# Altium project Rear.PrjPCB
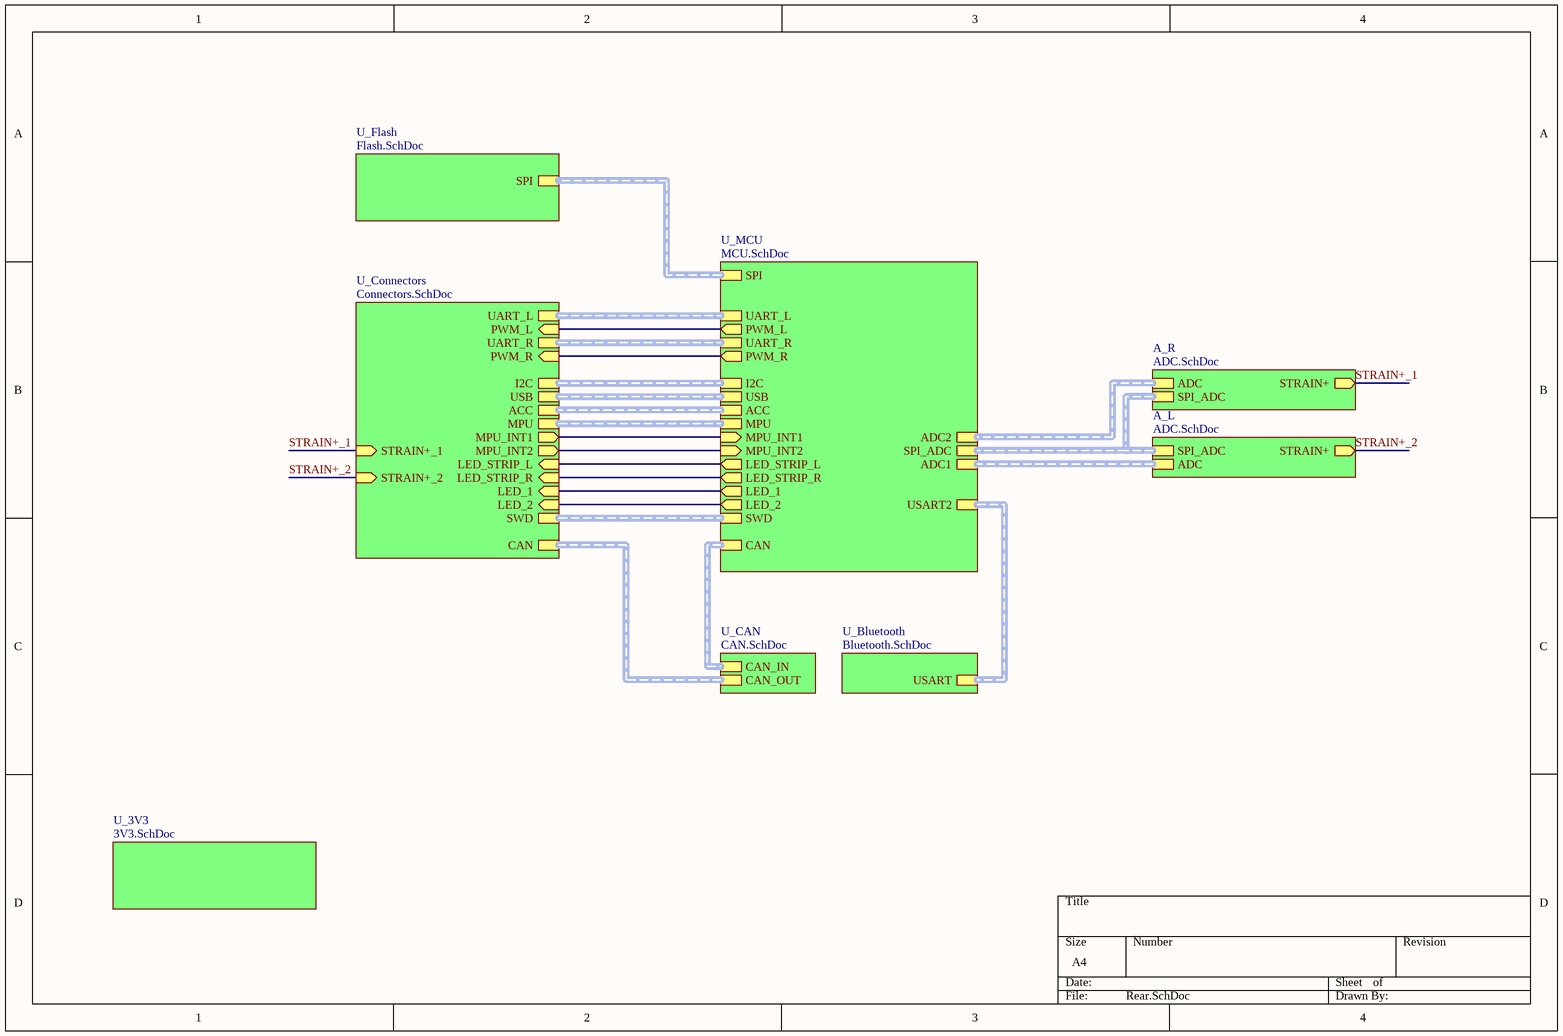
[diagram p0: Rear.SchDoc]
8 sheets, 135 parts. Net scope: hierarchical (ports join the sheet entries above them; power ports are global).
Board file: Rear.PcbDoc
Sheets:
  Rear.SchDoc
    U_MCU = MCU.SchDoc
    A_L = ADC.SchDoc
    A_R = ADC.SchDoc
    U_Connectors = Connectors.SchDoc
    U_CAN = CAN.SchDoc
    U_Bluetooth = Bluetooth.SchDoc
    U_3V3 = 3V3.SchDoc
    U_Flash = Flash.SchDoc

## Sheet Rear.SchDoc
size A4

### Sub-sheets
A_L = ADC.SchDoc: SPI_ADC (harness SPI_ADC), ADC (harness ADC), STRAIN+ (out)
A_R = ADC.SchDoc: SPI_ADC (harness SPI_ADC), ADC (harness ADC), STRAIN+ (out)
U_3V3 = 3V3.SchDoc: no entries
U_Bluetooth = Bluetooth.SchDoc: USART (harness UART)
U_CAN = CAN.SchDoc: CAN_IN (harness CAN Input), CAN_OUT (harness CAN Output)
U_Connectors = Connectors.SchDoc: USB (harness USB), ACC (harness Accessory Outputs), CAN (harness CAN Output), MPU (harness I2C), MPU_INT1 (out), MPU_INT2 (out), STRAIN+_1 (in), STRAIN+_2 (in), LED_STRIP_L (in), LED_STRIP_R (in), SWD (harness SWD), LED_1 (in), LED_2 (in), UART_L (harness UART), UART_R (harness UART), PWM_L (in), PWM_R (in), I2C (harness I2C)
U_Flash = Flash.SchDoc: SPI (harness SPI)
U_MCU = MCU.SchDoc: USB (harness USB), CAN (harness CAN Input), ACC (harness Accessory Outputs), I2C (harness I2C), SPI_ADC (harness SPI_ADC), USART2 (harness UART), ADC1 (harness ADC), ADC2 (harness ADC), MPU (harness I2C), MPU_INT1 (in), MPU_INT2 (in), SPI, LED_STRIP_L (out), LED_STRIP_R (out), SWD (harness SWD), LED_1 (out), LED_2 (out), UART_L (harness UART), UART_R (harness UART), PWM_L (out), PWM_R (out)

### Nets
STRAIN+_1: sheet A_R/STRAIN+, sheet U_Connectors/STRAIN+_1  [project net AINP]
STRAIN+_2: sheet A_L/STRAIN+, sheet U_Connectors/STRAIN+_2  [project net AINP]
NetJP1_3: sheet U_MCU/PWM_L, sheet U_Connectors/PWM_L
NetJP4_3: sheet U_MCU/PWM_R, sheet U_Connectors/PWM_R
NetJP8_2: sheet U_MCU/LED_STRIP_L, sheet U_Connectors/LED_STRIP_L
NetJP9_2: sheet U_MCU/LED_STRIP_R, sheet U_Connectors/LED_STRIP_R
NetJP10_1: sheet U_MCU/MPU_INT1, sheet U_Connectors/MPU_INT1
NetJP11_1: sheet U_MCU/MPU_INT2, sheet U_Connectors/MPU_INT2
NetJP16_2: sheet U_MCU/LED_1, sheet U_Connectors/LED_1
NetJP17_2: sheet U_MCU/LED_2, sheet U_Connectors/LED_2

### Buses and harness runs
harness sheet A_L/ADC = sheet U_MCU/ADC1
harness sheet A_L/SPI_ADC = sheet A_R/SPI_ADC = sheet U_MCU/SPI_ADC
harness sheet A_R/ADC = sheet U_MCU/ADC2
harness sheet U_Bluetooth/USART = sheet U_MCU/USART2
harness sheet U_CAN/CAN_IN = sheet U_MCU/CAN
harness sheet U_CAN/CAN_OUT = sheet U_Connectors/CAN
harness sheet U_Connectors/ACC = sheet U_MCU/ACC
harness sheet U_Connectors/I2C = sheet U_MCU/I2C
harness sheet U_Connectors/MPU = sheet U_MCU/MPU
harness sheet U_Connectors/SWD = sheet U_MCU/SWD
harness sheet U_Connectors/UART_L = sheet U_MCU/UART_L
harness sheet U_Connectors/UART_R = sheet U_MCU/UART_R
harness sheet U_Connectors/USB = sheet U_MCU/USB
harness sheet U_Flash/SPI = sheet U_MCU/SPI

## Sheet MCU.SchDoc
size A3; SheetNumber: 3
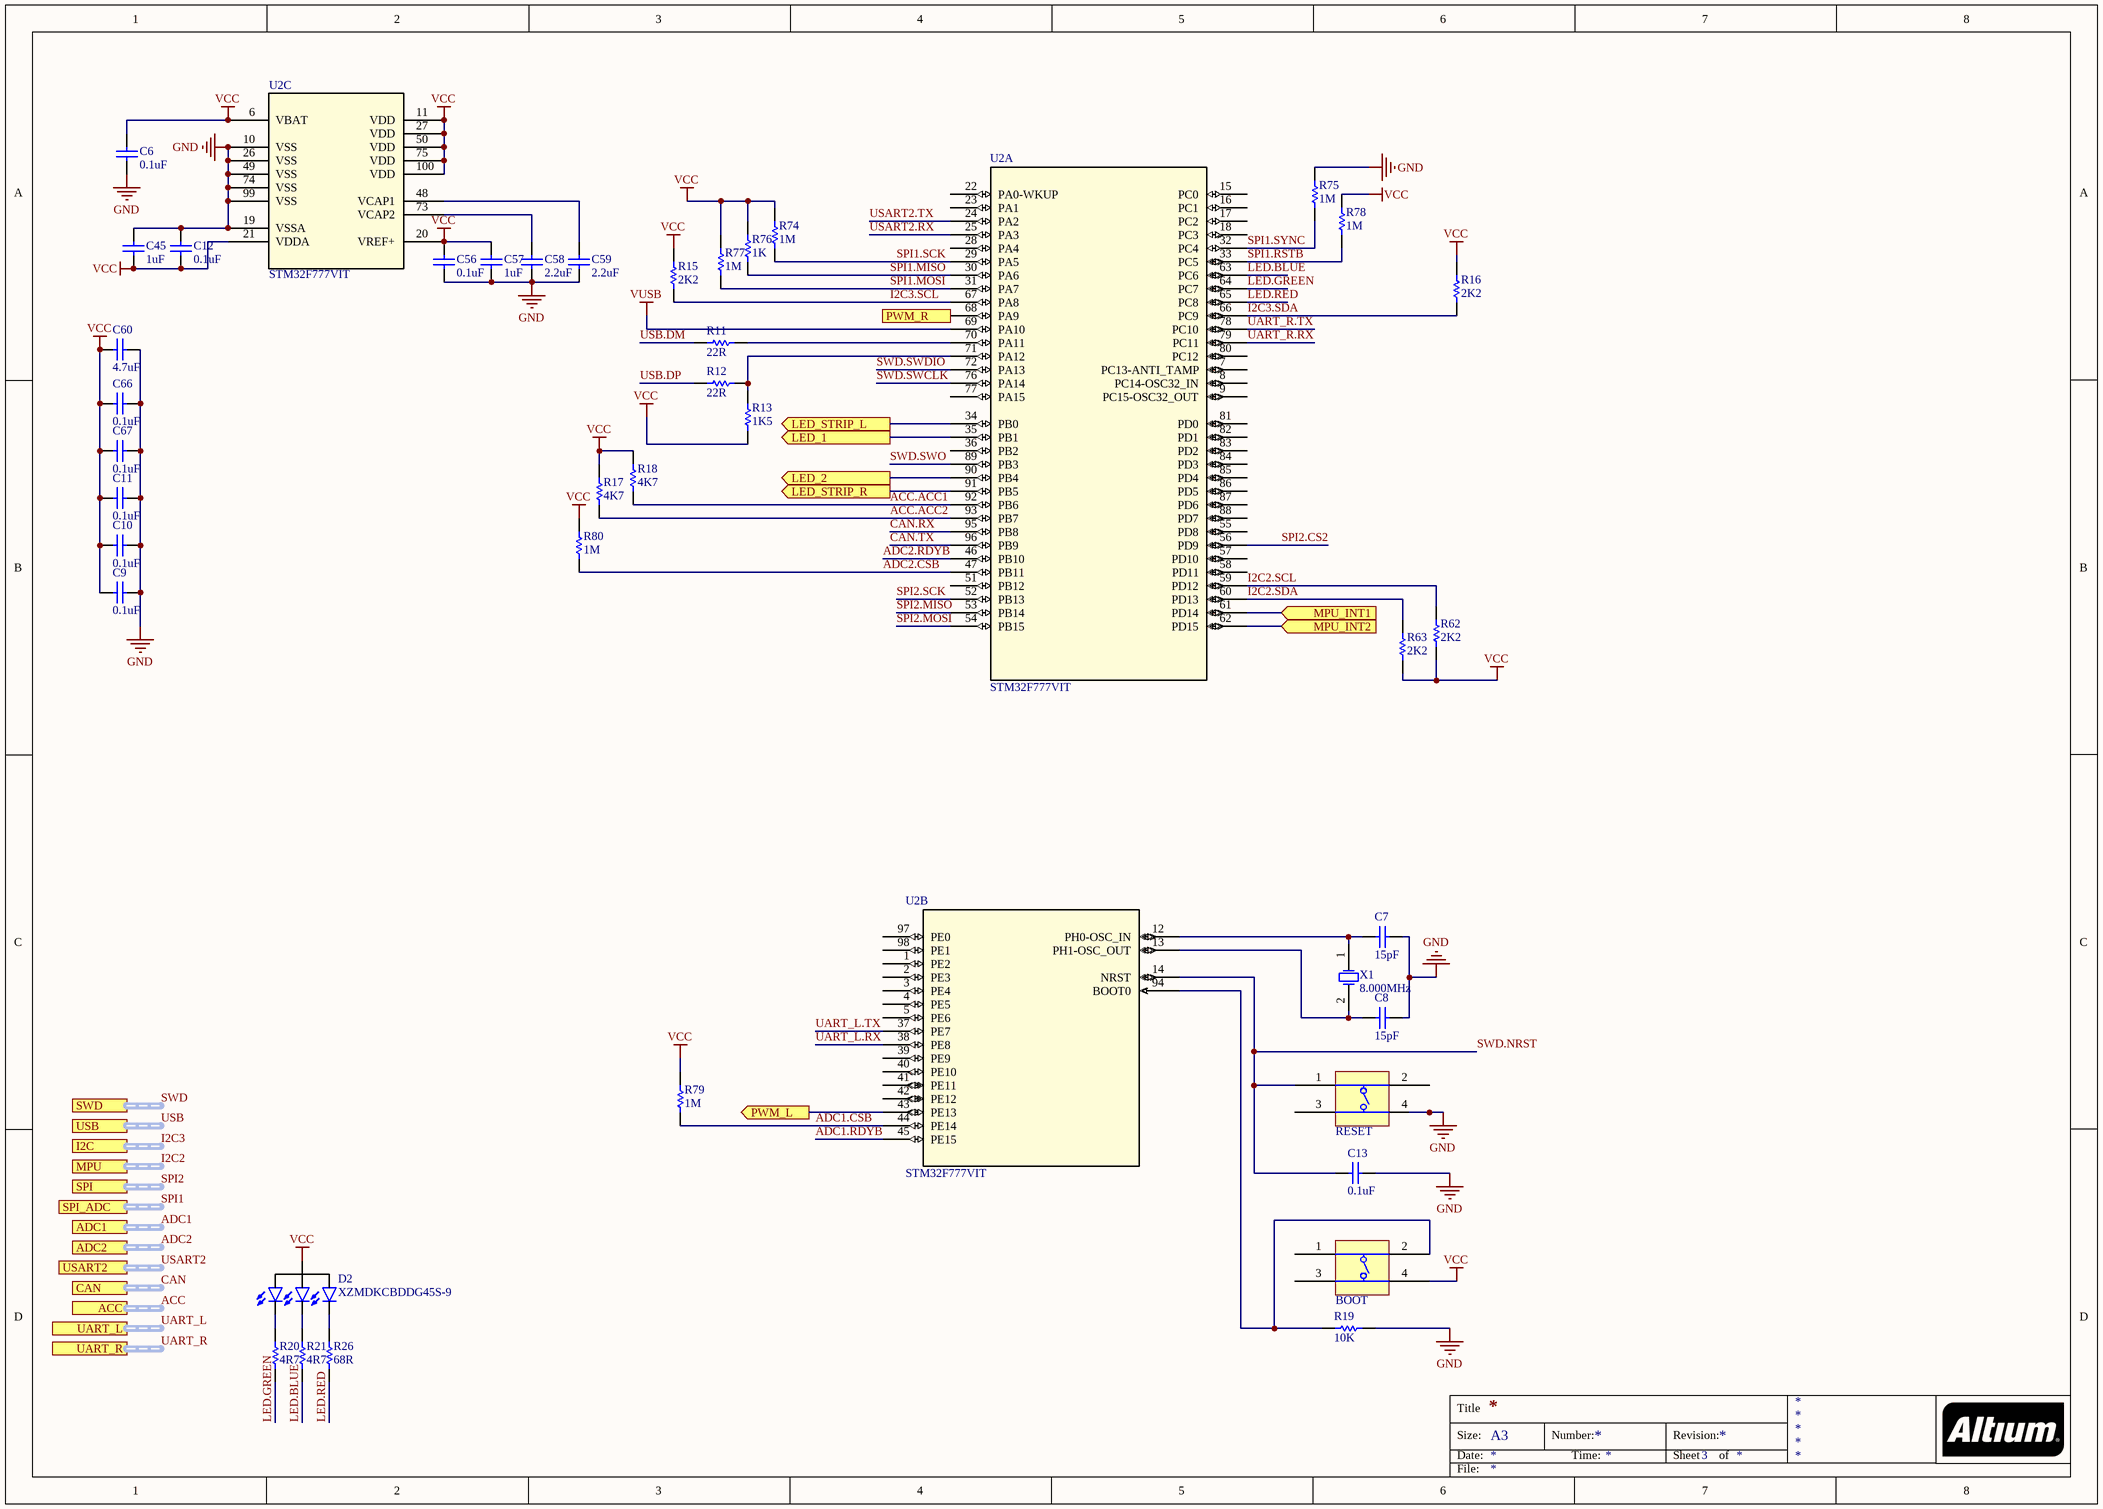
[diagram p1: MCU.SchDoc]

### Parts
BOOT  DIPT-DTSM-6  [SWITCH]  (value not drawn)
C6  value 0.1uF  [C0603[1608X92]]  (hidden comment: 0.1uF 6.3V 0603)
C7  value 15pF  [C0603[1608X92]]  (hidden comment: 15pF 6.3V 0603)
C8  value 15pF  [C0603[1608X92]]  (hidden comment: 15pF 6.3V 0603)
C9  value 0.1uF  [C0603[1608X92]]  (hidden comment: 0.1uF 6.3V 0603)
C10  value 0.1uF  [C0603[1608X92]]  (hidden comment: 0.1uF 6.3V 0603)
C11  value 0.1uF  [C0603[1608X92]]  (hidden comment: 0.1uF 6.3V 0603)
C12  value 0.1uF  [C0603[1608X92]]  (hidden comment: 0.1uF 6.3V 0603)
C13  value 0.1uF  [C0603[1608X92]]  (hidden comment: 0.1uF 6.3V 0603)
C45  value 1uF  [C0603[1608X92]]  (hidden comment: 1uF 6.3V 0603)
C56  value 0.1uF  [C0603[1608X92]]  (hidden comment: 0.1uF 6.3V 0603)
C57  value 1uF  [C0603[1608X92]]  (hidden comment: 1uF 6.3V 0603)
C58  value 2.2uF  [C1206[3216X160]]  (hidden comment: 2.2uF 6.3V 1206)
C59  value 2.2uF  [C1206[3216X160]]  (hidden comment: 2.2uF 6.3V 1206)
C60  value 4.7uF  [C0603[1608X92]]  (hidden comment: 4.7uF 6.3V 0603)
C66  value 0.1uF  [C0603[1608X92]]  (hidden comment: 0.1uF 6.3V 0603)
C67  value 0.1uF  [C0603[1608X92]]  (hidden comment: 0.1uF 6.3V 0603)
D2  XZMDKCBDDG45S-9  [XZMDKCBDDG45S-9]
R11  value 22R  [R0603[1608]]  (hidden comment: 22R 1% 0603)
R12  value 22R  [R0603[1608]]  (hidden comment: 22R 1% 0603)
R13  value 1K5  [R0603[1608]]  (hidden comment: 1K5 1% 0603)
R15  value 2K2  [R0603[1608]]  (hidden comment: 2K2 1% 0603)
R16  value 2K2  [R0603[1608]]  (hidden comment: 2K2 1% 0603)
R17  value 4K7  [R0603[1608]]  (hidden comment: 4K7 1% 0603)
R18  value 4K7  [R0603[1608]]  (hidden comment: 4K7 1% 0603)
R19  value 10K  [R0603[1608]]  (hidden comment: 10K 1% 0603)
R20  value 4R7  [R0603[1608]]  (hidden comment: 4R7 1% 0603)
R21  value 4R7  [R0603[1608]]  (hidden comment: 4R7 1% 0603)
R26  value 68R  [R0603[1608]]  (hidden comment: 68R 1% 0603)
R62  value 2K2  [R0603[1608]]  (hidden comment: 2K2 1% 0603)
R63  value 2K2  [R0603[1608]]  (hidden comment: 2K2 1% 0603)
R74  value 1M  [R0603[1608]]  (hidden comment: 1M 1% 0603)
R75  value 1M  [R0603[1608]]  (hidden comment: 1M 1% 0603)
R76  value 1K  [R0603[1608]]  (hidden comment: 1K 1% 0603)
R77  value 1M  [R0603[1608]]  (hidden comment: 1M 1% 0603)
R78  value 1M  [R0603[1608]]  (hidden comment: 1M 1% 0603)
R79  value 1M  [R0603[1608]]  (hidden comment: 1M 1% 0603)
R80  value 1M  [R0603[1608]]  (hidden comment: 1M 1% 0603)
RESET  DIPT-DTSM-6  [SWITCH]  (value not drawn)
U2  STM32F777VIT  [LQFP-100_14X14mm]  (parts A,B,C of 3)
X1  8.000MHz  [OSC_2SM_3R2x2R5]

### Ports
ACC (harness Accessory Outputs), ADC1 (harness ADC), ADC2 (harness ADC), CAN (harness CAN Input), I2C (harness I2C), LED_1 (out), LED_2 (out), LED_STRIP_L (out), LED_STRIP_R (out), MPU (harness I2C), MPU_INT1 (in), MPU_INT2 (in), PWM_L (out), PWM_R (out), SPI (harness SPI), SPI_ADC (harness SPI_ADC), SWD (harness SWD), UART_L (harness UART), UART_R (harness UART), USART2 (harness UART), USB (harness USB)

### Nets
GND: C6.1 C7.2 C8.2 C9.2 C10.2 C11.2 C12.2 C13.2 C45.2 C56.1 C57.1 C58.1 C59.1 C60.2 C66.2 C67.2 R19.2 R75.2 RESET.4 U2.10(VSS) U2.19(VSSA) U2.26(VSS) U2.49(VSS) U2.74(VSS) U2.99(VSS)
VCC: BOOT.4 C6.2 C9.1 C10.1 C11.1 C12.1 C45.1 C56.2 C57.2 C60.1 C66.1 C67.1 D2.2(A) R13.1 R15.1 R16.1 R17.2 R18.2 R62.1 R63.1 R74.1 R76.1 R77.1 R78.2 R79.1 R80.1 U2.6(VBAT) U2.11(VDD) U2.20(VREF+) U2.21(VDDA) U2.27(VDD) U2.50(VDD) U2.75(VDD) U2.100(VDD)
VUSB: U2.69(PA10)
ACC.ACC1: R18.1 U2.92(PB6)
ACC.ACC2: R17.1 U2.93(PB7)
ADC1.CSB: R79.2 U2.44(PE14)
ADC1.RDYB: U2.45(PE15)
ADC2.CSB: R80.2 U2.47(PB11)
ADC2.RDYB: U2.46(PB10)
CAN.RX: U2.95(PB8)
CAN.TX: U2.96(PB9)
I2C2.SCL: R62.2 U2.59(PD12)
I2C2.SDA: R63.2 U2.60(PD13)
I2C3.SCL: R15.2 U2.67(PA8)
I2C3.SDA: R16.2 U2.66(PC9)
LED.BLUE: R21.1 U2.63(PC6)
LED.GREEN: R20.1 U2.64(PC7)
LED.RED: R26.1 U2.65(PC8)
SPI1.MISO: R76.2 U2.30(PA6)
SPI1.MOSI: R77.2 U2.31(PA7)
SPI1.RSTB: R78.1 U2.33(PC5)
SPI1.SCK: R74.2 U2.29(PA5)
SPI1.SYNC: R75.1 U2.32(PC4)
SPI2.CS2: U2.56(PD9)
SPI2.MISO: U2.53(PB14)
SPI2.MOSI: U2.54(PB15)
SPI2.SCK: U2.52(PB13)
SWD.NRST: C13.1 RESET.1 U2.14(NRST)
SWD.SWCLK: U2.76(PA14)
SWD.SWDIO: U2.72(PA13)
SWD.SWO: U2.89(PB3)
UART_L.RX: U2.38(PE8)
UART_L.TX: U2.37(PE7)
UART_R.RX: U2.79(PC11)
UART_R.TX: U2.78(PC10)
USART2.RX: U2.25(PA3)
USART2.TX: U2.24(PA2)
USB.DM: R11.1
USB.DP: R12.1
NetBOOT_2: BOOT.2 R19.1 U2.94(BOOT0)
NetC7_1: C7.1 U2.12(PH0-OSC_IN) X1.1(OSC1)
NetC8_1: C8.1 U2.13(PH1-OSC_OUT) X1.2(OSC2)
NetC58_2: C58.2 U2.73(VCAP2)
NetC59_2: C59.2 U2.48(VCAP1)
NetD2_1: D2.1(K_Red) R26.2
NetD2_3: D2.3(K_Blue) R21.2
NetD2_4: D2.4(K_Green) R20.2
NetJP1_3: U2.43(PE13) ; port PWM_L
NetJP4_3: U2.68(PA9) ; port PWM_R
NetJP8_2: U2.34(PB0) ; port LED_STRIP_L
NetJP9_2: U2.91(PB5) ; port LED_STRIP_R
NetJP10_1: U2.61(PD14) ; port MPU_INT1
NetJP11_1: U2.62(PD15) ; port MPU_INT2
NetJP16_2: U2.35(PB1) ; port LED_1
NetJP17_2: U2.90(PB4) ; port LED_2
NetR11_2: R11.2 U2.70(PA11)
NetR12_2: R12.2 R13.2 U2.71(PA12)

Not connected (* = marked no-connect by the designer): BOOT 1 3; RESET 2 3; U2 1(PE2) 2(PE3) 3(PE4) 4(PE5) 5(PE6) 7(PC13-ANTI_TAMP) 8(PC14-OSC32_IN) 9(PC15-OSC32_OUT) 15(PC0) 16(PC1) 17(PC2) 18(PC3) 22(PA0-WKUP) 23(PA1) 28(PA4) 36(PB2) 39(PE9) 40(PE10) 41(PE11) 42(PE12) 51(PB12) 55(PD8) 57(PD10) 58(PD11) 77(PA15) 80(PC12) 81(PD0) 82(PD1) 83(PD2) 84(PD3) 85(PD4) 86(PD5) 87(PD6) 88(PD7) 97(PE0) 98(PE1)

### Buses and harness runs
harness ACC = port ACC
harness ADC1 = port ADC1
harness ADC2 = port ADC2
harness CAN = port CAN
harness I2C2 = port MPU
harness I2C3 = port I2C
harness SPI1 = port SPI_ADC
harness SPI2 = port SPI
harness SWD = port SWD
harness UART_L = port UART_L
harness UART_R = port UART_R
harness USART2 = port USART2
harness USB = port USB

### Notes on the sheet
- Title
- Size:
- Date:
- A3
- Number:
- Time:
- Revision:
- Sheet
- of
- File:

### Library data of the parts
C6 C9-C13 C56 C66 C67 = CAP_0.1uF_6.3V_0603_10%: 0.1uF 6.3V 10% 0603 (1608 Metric); PartNumber: GRM188R70J104KA01D; Manufacturer: Murata; Mounting Technology: Surface Mount; PackageReference: 0603; PackageDescription: 0603 (1608 Metric); Voltage: 6.3V; Tolerance: 10%
C7 C8 = CAP_15pF_6.3V_0603_1%: 15pF 6.3V 1% 0603 (1608 Metric); PartNumber: CBR02C150F9GAC; Manufacturer: KEMET; TemperatureCoefficient: C0G; Mounting Technology: Surface Mount; PackageReference: 0603; PackageDescription: 0603 (1608 Metric); Voltage: 6.3V; Tolerance: 1%
C45 C57 = CAP_1uF_6.3V_0603_10%: 1uF 6.3V 10% 0603 (1608 Metric); PartNumber: GRM188R60J105KA01D; Manufacturer: Murata; TemperatureCoefficient: X5R; Mounting Technology: Surface Mount; PackageReference: 0603; PackageDescription: 0603 (1608 Metric); Voltage: 6.3V; Tolerance: 10%
C58 C59 = CAP_2.2uF_16V_1206_10%: 2.2uF 6.3V 10% 1206 (3216 Metric); PartNumber: GRM31CR60J476KE19L; Manufacturer: Murata; Voltage: 16V; Mounting Technology: Surface Mount; PackageReference: 1206; PackageDescription: 1206 (3216 Metric); Tolerance: 10%
C60 = CAP_4.7uF_6.3V_0603_10%: 4.7uF 6.3V 10% 0603 (1608 Metric); PartNumber: GRM188R60J475KE19D; Manufacturer: Murata; TemperatureCoefficient: X5R; Mounting Technology: Surface Mount; PackageReference: 0603; PackageDescription: 0603 (1608 Metric); Voltage: 6.3V; Tolerance: 10%
D2 = XZMDKCBDDG45S-9: Manufacturer: SunLED; PartNumber: XZMDKCBDDG45S-9; PackageReference: 4-PLCC; Mounting Technology: Surface Mount; PackageDescription: 4-SMD, Gull Wing,  3.20mm L x 2.80mm W
R11 R12 = RES_22R_0603_1%: 22R 0.25W 1% 0603 (1005 Metric); Manufacturer: Vishay / Dale; PartNumber: CRCW060322R0FKEAHP; Tolerance: 1%; Power: 0.25W; Mounting Technology: Surface Mount; PackageReference: 0603; PackageDescription: 0603 (1608 Metric); ComponentLink1Description: Datasheet; ComponentLink1URL: http://www.vishay.com/docs/20043/crcwhpe3.pdf
R13 = RES_1K5_0603_1%: 1K5 0.25W 1% 0603 (1005 Metric); Manufacturer: Vishay / Dale; PartNumber: CRCW06031K50FKEAHP; Tolerance: 1%; Power: 0.25W; Mounting Technology: Surface Mount; PackageReference: 0603; PackageDescription: 0603 (1608 Metric); ComponentLink1Description: Datasheet; ComponentLink1URL: http://www.vishay.com/docs/20043/crcwhpe3.pdf
R15 R16 R62 R63 = RES_2K2_0603_1%: 2K2 0.25W 1% 0603 (1005 Metric); Manufacturer: Vishay / Dale; PartNumber: CRCW06032K20FKEAHP; Tolerance: 1%; Power: 0.25W; Mounting Technology: Surface Mount; PackageReference: 0603; PackageDescription: 0603 (1608 Metric); ComponentLink1Description: Datasheet; ComponentLink1URL: http://www.vishay.com/docs/20043/crcwhpe3.pdf
R17 R18 = RES_4K7_0603_1%: 4K7 0.25W 1% 0603 (1005 Metric); Manufacturer: Vishay / Dale; PartNumber: CRCW06034K70FKEAHP; Tolerance: 1%; Power: 0.25W; Mounting Technology: Surface Mount; PackageReference: 0603; PackageDescription: 0603 (1608 Metric); ComponentLink1Description: Datasheet; ComponentLink1URL: http://www.vishay.com/docs/20043/crcwhpe3.pdf
R19 = RES_10K_0603_1%: 10K 0.25W 1% 0603 (1005 Metric); Manufacturer: Vishay; PartNumber: RCS060310K0FKEA; Tolerance: 1%; Power: 0.25W; Mounting Technology: Surface Mount; PackageReference: 0603; PackageDescription: 0603 (1608 Metric); ComponentLink1Description: Datasheet; ComponentLink1URL: http://www.vishay.com/docs/20065/rcse3.pdf
R20 R21 = RES_4R7_0603_1%: 4R7 0.25W 1% 0603 (1005 Metric); Manufacturer: Vishay / Dale; PartNumber: CRCW06034R70JNEAHP; Tolerance: 1%; Power: 0.25W; Mounting Technology: Surface Mount; PackageReference: 0603; PackageDescription: 0603 (1608 Metric); ComponentLink1Description: Datasheet; ComponentLink1URL: http://www.vishay.com/docs/20043/crcwhpe3.pdf
R26 = RES_68R_0603_1%: 68R 0.25W 1% 0603 (1005 Metric); Manufacturer: Vishay / Dale; PartNumber: CRCW06036R80FKEAHP; Tolerance: 1%; Power: 0.25W; Mounting Technology: Surface Mount; PackageReference: 0603; PackageDescription: 0603 (1608 Metric); ComponentLink1Description: Datasheet; ComponentLink1URL: http://www.vishay.com/docs/20043/crcwhpe3.pdf
R74 R75 R77-R80 = RES_1M_0603_1%: 1M 0.25W 1% 0603 (1005 Metric); Manufacturer: Vishay / Dale; PartNumber: CRCW06031M00JNEAHP; Tolerance: 5%; Power: 0.25W; Mounting Technology: Surface Mount; PackageReference: 0603; PackageDescription: 0603 (1608 Metric); ComponentLink1Description: Datasheet; ComponentLink1URL: http://www.vishay.com/docs/20043/crcwhpe3.pdf
R76 = RES_1K_0603_1%: 1K 0.25W 1% 0603 (1005 Metric); Manufacturer: Vishay / Dale; PartNumber: CRCW06031K00FKEAHP; Tolerance: 1%; Power: 0.25W; Mounting Technology: Surface Mount; PackageReference: 0603; PackageDescription: 0603 (1608 Metric); ComponentLink1Description: Datasheet; ComponentLink1URL: http://www.vishay.com/docs/20043/crcwhpe3.pdf
U2 = STM32F777VIT: Imported; Manufacturer: STMicroelectronics; Value: Value; Type: Type; RefDes: RefDes; PartNumber: STM32F777VIT
X1 = XTAL: Crystal Oscillator; Manufacturer: NX; PartNumber: NX3225GD-8.000M-EXS00A-CG04874; PackageReference: R38; Value: 8.000MHz

## Sheet ADC.SchDoc
size A4
Used 2 times, as channels A_L, A_R. Parts and nets are listed once, with the designators drawn on the sheet.
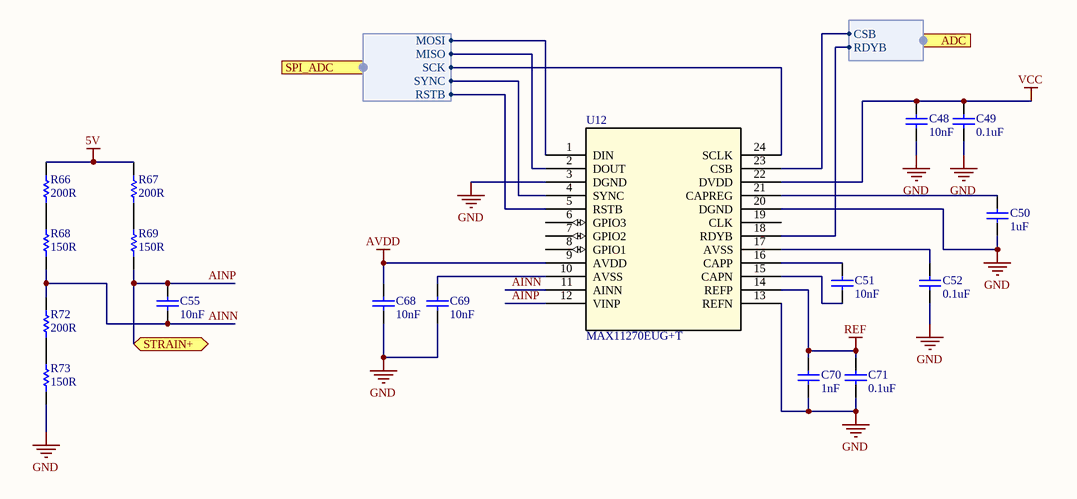
[diagram p2: ADC.SchDoc]

### Parts
C48  value 10nF  [C0603[1608X92]]  (hidden comment: 10nF 6.3V 0603)
C49  value 0.1uF  [C0603[1608X92]]  (hidden comment: 0.1uF 6.3V 0603)
C50  value 1uF  [C0603[1608X92]]  (hidden comment: 1uF 6.3V 0603)
C51  value 10nF  [C0603[1608X92]]  (hidden comment: 10nF 6.3V 0603)
C52  value 0.1uF  [C0603[1608X92]]  (hidden comment: 0.1uF 6.3V 0603)
C55  value 10nF  [C0603[1608X92]]  (hidden comment: 10nF 6.3V 0603)
C68  value 10nF  [C0603[1608X92]]  (hidden comment: 10nF 6.3V 0603)
C69  value 10nF  [C0603[1608X92]]  (hidden comment: 10nF 6.3V 0603)
C70  value 1nF  [C0603[1608X92]]  (hidden comment: 1nF 6.3V 0603)
C71  value 0.1uF  [C0603[1608X92]]  (hidden comment: 0.1uF 6.3V 0603)
R66  value 200R  [R0603[1608]]  (hidden comment: 200R 1% 0603)
R67  value 200R  [R0603[1608]]  (hidden comment: 200R 1% 0603)
R68  value 150R  [R0603[1608]]  (hidden comment: 150R 1% 0603)
R69  value 150R  [R0603[1608]]  (hidden comment: 150R 1% 0603)
R72  value 200R  [R0603[1608]]  (hidden comment: 200R 1% 0603)
R73  value 150R  [R0603[1608]]  (hidden comment: 150R 1% 0603)
U12  MAX11270EUG+T  [21-0066J_24]

### Ports
ADC (harness ADC), SPI_ADC (harness SPI_ADC), STRAIN+ (bidir)

### Harnesses
SPI_ADC: MOSI, MISO, SCK, SYNC, RSTB
ADC: CSB, RDYB

### Nets
5V: R66.2 R67.2
AVDD: C68.2 U12.9(AVDD)
GND: C48.1 C49.1 C50.1 C52.1 C68.1 C69.1 C70.1 C71.1 R73.1 U12.3(DGND) U12.13(REFN) U12.20(DGND)
REF: C70.2 C71.2 U12.14(REFP)
VCC: C48.2 C49.2 U12.22(DVDD)
AINN: C55.1 R68.1 R72.2 U12.11(AINN)
AINP: C55.2 R69.1 U12.12(VINP) ; port STRAIN+
NetC50_2: C50.2 U12.21(CAPREG)
NetC51_1: C51.1 U12.15(CAPN)
NetC51_2: C51.2 U12.16(CAPP)
NetC52_2: C52.2 U12.17(AVSS)
NetC69_2: C69.2 U12.10(AVSS)
NetR66_1: R66.1 R68.2
NetR67_1: R67.1 R69.2
NetR72_1: R72.1 R73.2
NetU12_1: U12.1(DIN) ; port SPI_ADC.MOSI
NetU12_2: U12.2(DOUT) ; port SPI_ADC.MISO
NetU12_4: U12.4(SYNC) ; port SPI_ADC.SYNC
NetU12_5: U12.5(RSTB) ; port SPI_ADC.RSTB
NetU12_18: U12.18(RDYB) ; port ADC.RDYB
NetU12_23: U12.23(CSB) ; port ADC.CSB
NetU12_24: U12.24(SCLK) ; port SPI_ADC.SCK

Not connected (* = marked no-connect by the designer): U12 6(GPIO3) 7(GPIO2) 8(GPIO1) 19(CLK)

### Channels
A_L: designators end in _A_L; ports STRAIN+=AINP
A_R: designators end in _A_R; ports STRAIN+=AINP

### Library data of the parts
C48 C51 C55 C68 C69 = CAP_10nF_6.3V_0603_10%: 10nF 6.3V 10% 0603 (1608 Metric); PartNumber: GRM188R70J103KA01D; Manufacturer: Murata; TemperatureCoefficient: X7R; Mounting Technology: Surface Mount; PackageReference: 0603; PackageDescription: 0603 (1608 Metric); Voltage: 6.3V; Tolerance: 10%
C49 C52 C71 = CAP_0.1uF_6.3V_0603_10%: as C6 on sheet MCU; Mounting Technology: Surface Mount; PackageReference: 0603; PackageDescription: 0603 (1608 Metric); Voltage: 6.3V; Tolerance: 10%
C50 = CAP_1uF_6.3V_0603_10%: as C45 on sheet MCU; Mounting Technology: Surface Mount; PackageReference: 0603; PackageDescription: 0603 (1608 Metric); Voltage: 6.3V; Tolerance: 10%
C70 = CAP_1nF_6.3V_0603_5%: 1nF 6.3V 5% 0603 (1608 Metric); PartNumber: GRM1885C1H102JA01D; Manufacturer: Murata; TemperatureCoefficient: C0G; Mounting Technology: Surface Mount; PackageReference: 0603; PackageDescription: 0603 (1608 Metric); Voltage: 6.3V; Tolerance: 5%
R66 R67 R72 = RES_200R_0603_1%: 200R 0.25W 1% 0603 (1005 Metric); Manufacturer: Vishay / Dale; PartNumber: CRCW0603200RFKEAHP; Tolerance: 1%; Power: 0.25W; Mounting Technology: Surface Mount; PackageReference: 0603; PackageDescription: 0603 (1608 Metric); ComponentLink1Description: Datasheet; ComponentLink1URL: http://www.vishay.com/docs/20043/crcwhpe3.pdf
R68 R69 R73 = RES_150R_0603_1%: 150R 0.25W 1% 0603 (1005 Metric); Manufacturer: Vishay / Dale; PartNumber: CRCW0603150RFKEAHP; Tolerance: 1%; Power: 0.25W; Mounting Technology: Surface Mount; PackageReference: 0603; PackageDescription: 0603 (1608 Metric); ComponentLink1Description: Datasheet; ComponentLink1URL: http://www.vishay.com/docs/20043/crcwhpe3.pdf
U12 = MAX11270EUG+T: Imported; PartNumber: MAX111270EUG+T; Manufacturer: Maxim; Value: Value; Type: Type; RefDes: RefDes

## Sheet Connectors.SchDoc
size A; SheetNumber: 13
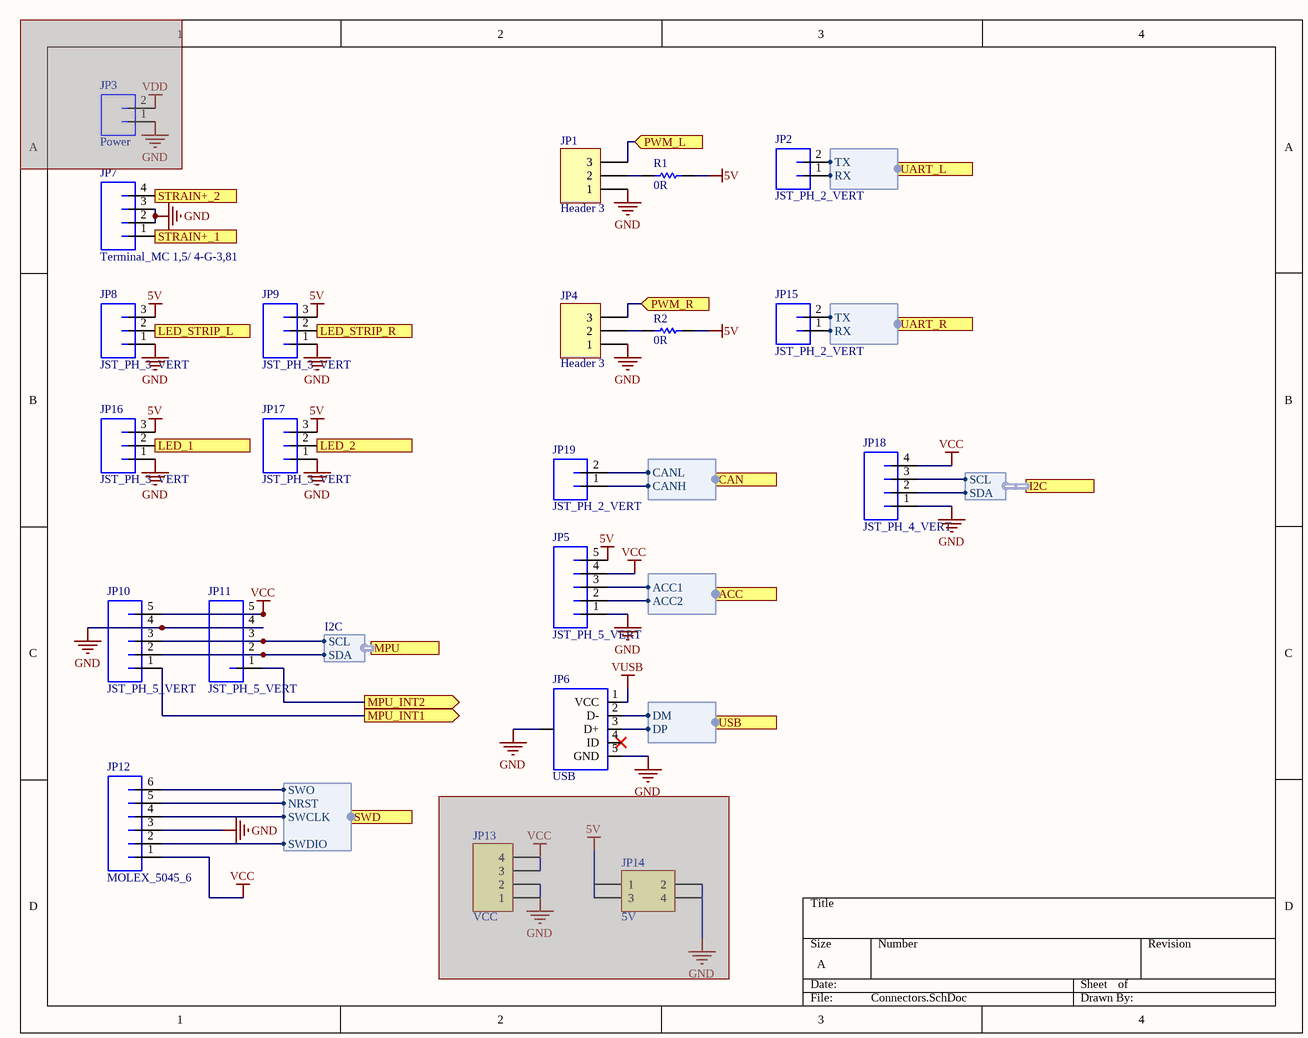
[diagram p3: Connectors.SchDoc]

### Parts
JP1  Header 3  [HDR1X3]
JP2  JST_PH_2_VERT  [JST-PH-2-PTH-VERT]
JP3  Power  [JST-PH-2-PTH-VERT]  (masked out: inside a compile mask, not in the netlist)
JP4  Header 3  [HDR1X3]
JP5  JST_PH_5_VERT  [JST-PH-5-PTH-VERT]
JP6  USB  [USB-MICROB_HORZ]
JP7  Terminal_MC 1,5/ 4-G-3,81  [Terminal-3.81-HORZ]
JP8  JST_PH_3_VERT  [JST-PH-3-PTH-VERT]
JP9  JST_PH_3_VERT  [JST-PH-3-PTH-VERT]
JP10  JST_PH_5_VERT  [JST-PH-5-PTH-VERT]
JP11  JST_PH_5_VERT  [JST-PH-5-PTH-VERT]
JP12  MOLEX_5045_6  [MOLEX_5045_6]
JP13  VCC  [HDR1X4]  (masked out: inside a compile mask, not in the netlist)
JP14  5V  [HDR2X2]  (masked out: inside a compile mask, not in the netlist)
JP15  JST_PH_2_VERT  [JST-PH-2-PTH-VERT]
JP16  JST_PH_3_VERT  [JST-PH-3-PTH-VERT]
JP17  JST_PH_3_VERT  [JST-PH-3-PTH-VERT]
JP18  JST_PH_4_VERT  [JST-PH-4-PTH-VERT]
JP19  JST_PH_2_VERT  [JST-PH-2-PTH-VERT]
R1  value 0R  [R0603[1608]]  (hidden comment: 0R 1% 0603)
R2  value 0R  [R0603[1608]]  (hidden comment: 0R 1% 0603)

### Ports
ACC (harness Accessory Outputs), CAN (harness CAN Output), I2C (harness I2C), LED_1 (in), LED_2 (in), LED_STRIP_L (in), LED_STRIP_R (in), MPU (harness I2C), MPU_INT1 (out), MPU_INT2 (out), PWM_L (in), PWM_R (in), STRAIN+_1 (in), STRAIN+_2 (in), SWD (harness SWD), UART_L (harness UART), UART_R (harness UART), USB (harness USB)

### Harnesses
USB: DM, DP
Accessory Outputs: ACC1, ACC2
CAN Output: CANL, CANH
I2C: SCL, SDA
SWD: SWCLK, SWDIO, SWO, NRST
UART: TX, RX

### Nets
5V: JP5.5 JP8.3 JP9.3 JP16.3 JP17.3 R1.2 R2.2
GND: JP1.1 JP4.1 JP5.1 JP6.5(GND) JP6.6(SHIELD) JP7.2 JP7.3 JP8.1 JP9.1 JP10.4 JP11.4 JP12.3 JP16.1 JP17.1 JP18.1
VCC: JP5.4 JP10.5 JP11.5 JP12.1 JP18.4
VUSB: JP6.1(VCC)
ACC.ACC1: JP5.3 ; port ACC.ACC1
ACC.ACC2: JP5.2 ; port ACC.ACC2
AINP: JP7.4 ; port STRAIN+_2
AINP: JP7.1 ; port STRAIN+_1  [a separate net that carries the same name]
I2C2.SCL: JP10.3 JP11.3 ; port MPU.SCL
I2C2.SDA: JP10.2 JP11.2 ; port MPU.SDA
I2C3.SCL: JP18.3 ; port I2C.SCL
I2C3.SDA: JP18.2 ; port I2C.SDA
SWD.NRST: JP12.5 ; port SWD.NRST
SWD.SWCLK: JP12.4 ; port SWD.SWCLK
SWD.SWDIO: JP12.2 ; port SWD.SWDIO
SWD.SWO: JP12.6 ; port SWD.SWO
UART_L.RX: JP2.1 ; port UART_L.RX
UART_L.TX: JP2.2 ; port UART_L.TX
UART_R.RX: JP15.1 ; port UART_R.RX
UART_R.TX: JP15.2 ; port UART_R.TX
USB.DM: JP6.2(D-) ; port USB.DM
USB.DP: JP6.3(D+) ; port USB.DP
NetJP1_2: JP1.2 R1.1
NetJP1_3: JP1.3 ; port PWM_L
NetJP4_2: JP4.2 R2.1
NetJP4_3: JP4.3 ; port PWM_R
NetJP8_2: JP8.2 ; port LED_STRIP_L
NetJP9_2: JP9.2 ; port LED_STRIP_R
NetJP10_1: JP10.1 ; port MPU_INT1
NetJP11_1: JP11.1 ; port MPU_INT2
NetJP16_2: JP16.2 ; port LED_1
NetJP17_2: JP17.2 ; port LED_2
NetJP19_1: JP19.1 ; port CAN.CANH
NetJP19_2: JP19.2 ; port CAN.CANL

Not connected (* = marked no-connect by the designer): JP6 4(ID)*

### Library data of the parts
JP1 JP4 = Header 3: Header, 3-Pin; LatestRevisionDate: 17-Jul-2002; LatestRevisionNote: Re-released for DXP Platform.; Publisher: Altium Limited
JP2 JP15 JP19 = JST_PH_2_VERT: Manufacturer: JST Sales America Inc.; PartNumber: B2B-PH-K-S(LF)(SN); Mounting Technology: Through Hole; PackageReference: JST-PH
JP3 = JST_PH_2_VERT: Manufacturer: JST Sales America, Inc.; PartNumber: B2B-PH-K-S(LF)(SN); Mounting Technology: Through Hole; PackageReference: JST-PH
JP5 JP10 JP11 = JST_PH_5_VERT: Manufacturer: JST Sales America, Inc.; PartNumber: B5B-PH-K-S(LF)(SN); PackageReference: JST-PH; Mounting Technology: Through Hole
JP6 = USB_MICROB_SMT: pin to pad: 1>VBUS 2>D- 3>D+ 4>ID 5>GND 6>MT1+P$1+P$2+MT2; PartNumber: 10118192-0001LF; Manufacturer: Amphenol FCI; Mounting Technology: Surface Mount; PackageReference: USB - Micro B
JP7 = Terminal_MC 1,5/ 4-G-3,81: PartNumber: 1803293; Manufacturer: Phoenix Contact; MatePart: 1803594; PackageReference: MC; Mounting Technology: Through Hole
JP8 JP9 JP16 JP17 = JST_PH_3_VERT: Manufacturer: JST Sales America Inc.; PartNumber: B3B-PH-K-S(LF)(SN); Mounting Technology: Through Hole; PackageReference: JST-PH
JP12 = MOLEX_5045_6: PartNumber: B6B-PH-K-S(LF)(SN); Manufacturer: JST Sales America Inc.; PackageReference: JST-PH; Mounting Technology: Through Hole
JP13 = Header 4: Header, 4-Pin; LatestRevisionDate: 17-Jul-2002; LatestRevisionNote: Re-released for DXP Platform.; Publisher: Altium Limited
JP14 = Header 2X2: Header, 2-Pin, Dual row; LatestRevisionDate: 17-Jul-2002; LatestRevisionNote: Re-released for DXP Platform.; Publisher: Altium Limited
JP18 = JST_PH_4_VERT: PartNumber: B4B-PH-K-S(LF)(SN); Manufacturer: JST Sales America Inc.; PackageReference: JST-PH; Mounting Technology: Through Hole
R1 R2 = RES_0R_0603_1%: 0R 0.25W 1% 0603 (1005 Metric); Manufacturer: Vishay / Dale; PartNumber: CRCW06030000Z0EAHP; Tolerance: 1%; Power: 0.25W; Mounting Technology: Surface Mount; PackageReference: 0603; PackageDescription: 0603 (1608 Metric); ComponentLink1Description: Datasheet; ComponentLink1URL: http://www.vishay.com/docs/20043/crcwhpe3.pdf

## Sheet CAN.SchDoc
size A; SheetNumber: 9
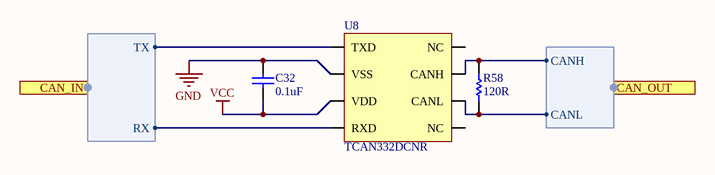
[diagram p4: CAN.SchDoc]

### Parts
C32  value 0.1uF  [C0603[1608X92]]  (hidden comment: 0.1uF 6.3V 0603)
R58  value 120R  [R0603[1608]]  (hidden comment: 120R 1% 0603)
U8  TCAN332DCNR  [SOT-23-8]

### Ports
CAN_IN (harness CAN Input), CAN_OUT (harness CAN Output)

### Harnesses
CAN Input: TX, RX
CAN Output: CANH, CANL

### Nets
GND: C32.2 U8.2(VSS)
VCC: C32.1 U8.3(VDD)
CAN.RX: U8.4(RXD) ; port CAN_IN.RX
CAN.TX: U8.1(TXD) ; port CAN_IN.TX
NetJP19_1: R58.2 U8.7(CANH) ; port CAN_OUT.CANH
NetJP19_2: R58.1 U8.6(CANL) ; port CAN_OUT.CANL

Not connected (* = marked no-connect by the designer): U8 5(NC) 8(NC)

### Library data of the parts
C32 = CAP_0.1uF_6.3V_0603_10%: as C6 on sheet MCU; Mounting Technology: Surface Mount; PackageReference: 0603; PackageDescription: 0603 (1608 Metric); Voltage: 6.3V; Tolerance: 10%
R58 = RES_120R_0603_1%: 120R 0.25W 1% 0603 (1005 Metric); Manufacturer: Vishay / Dale; PartNumber: CRCW0603120RFKEAHP; Tolerance: 1%; Power: 0.25W; Mounting Technology: Surface Mount; PackageReference: 0603; PackageDescription: 0603 (1608 Metric); ComponentLink1Description: Datasheet; ComponentLink1URL: http://www.vishay.com/docs/20043/crcwhpe3.pdf
U8 = TCAN332DCNR: CAN Interface IC 3.3-V CAN Transceivers with CAN FD (Flexible Data Rate) 8-SOT-23 -40 to 125; Manufacturer: Texas Instruments; Mounting Technology: Surface Mount; PackageReference: SOT-23-8; PackageDescription: SOT23, 8-Leads; PartNumber: TCAN332DCNR

## Sheet Bluetooth.SchDoc
size A4
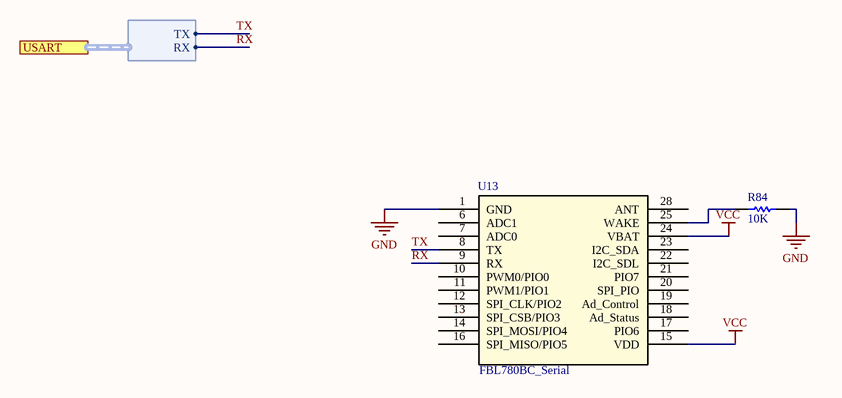
[diagram p5: Bluetooth.SchDoc]

### Parts
R84  value 10K  [R0603[1608]]  (hidden comment: 10K 1% 0603)
U13  FBL780BC_Serial  [FBL780BC_Serial]

### Ports
USART (harness UART)

### Harnesses
UART: TX, RX

### Nets
GND: R84.2 U13.1(GND)
VCC: U13.15(VDD) U13.24(VBAT)
RX: U13.9(RX) ; port USART.RX
TX: U13.8(TX) ; port USART.TX
NetR84_1: R84.1 U13.25(WAKE)

Not connected (* = marked no-connect by the designer): U13 6(ADC1) 7(ADC0) 10(PWM0/PIO0) 11(PWM1/PIO1) 12(SPI_CLK/PIO2) 13(SPI_CSB/PIO3) 14(SPI_MOSI/PIO4) 16(SPI_MISO/PIO5) 17(PIO6) 18(Ad_Status) 19(Ad_Control) 20(SPI_PIO) 21(PIO7) 22(I2C_SDL) 23(I2C_SDA) 28(ANT)

### Library data of the parts
R84 = RES_10K_0603_1%: as R19 on sheet MCU; Tolerance: 1%; Power: 0.25W; Mounting Technology: Surface Mount; PackageReference: 0603; PackageDescription: 0603 (1608 Metric); ComponentLink1Description: Datasheet; ComponentLink1URL: http://www.vishay.com/docs/20065/rcse3.pdf
U13 = FBL780BC_Serial: Manufacturer: Firmtech; PartNumber: FBL780BC_Serial

## Sheet 3V3.SchDoc
size A; SheetNumber: 2
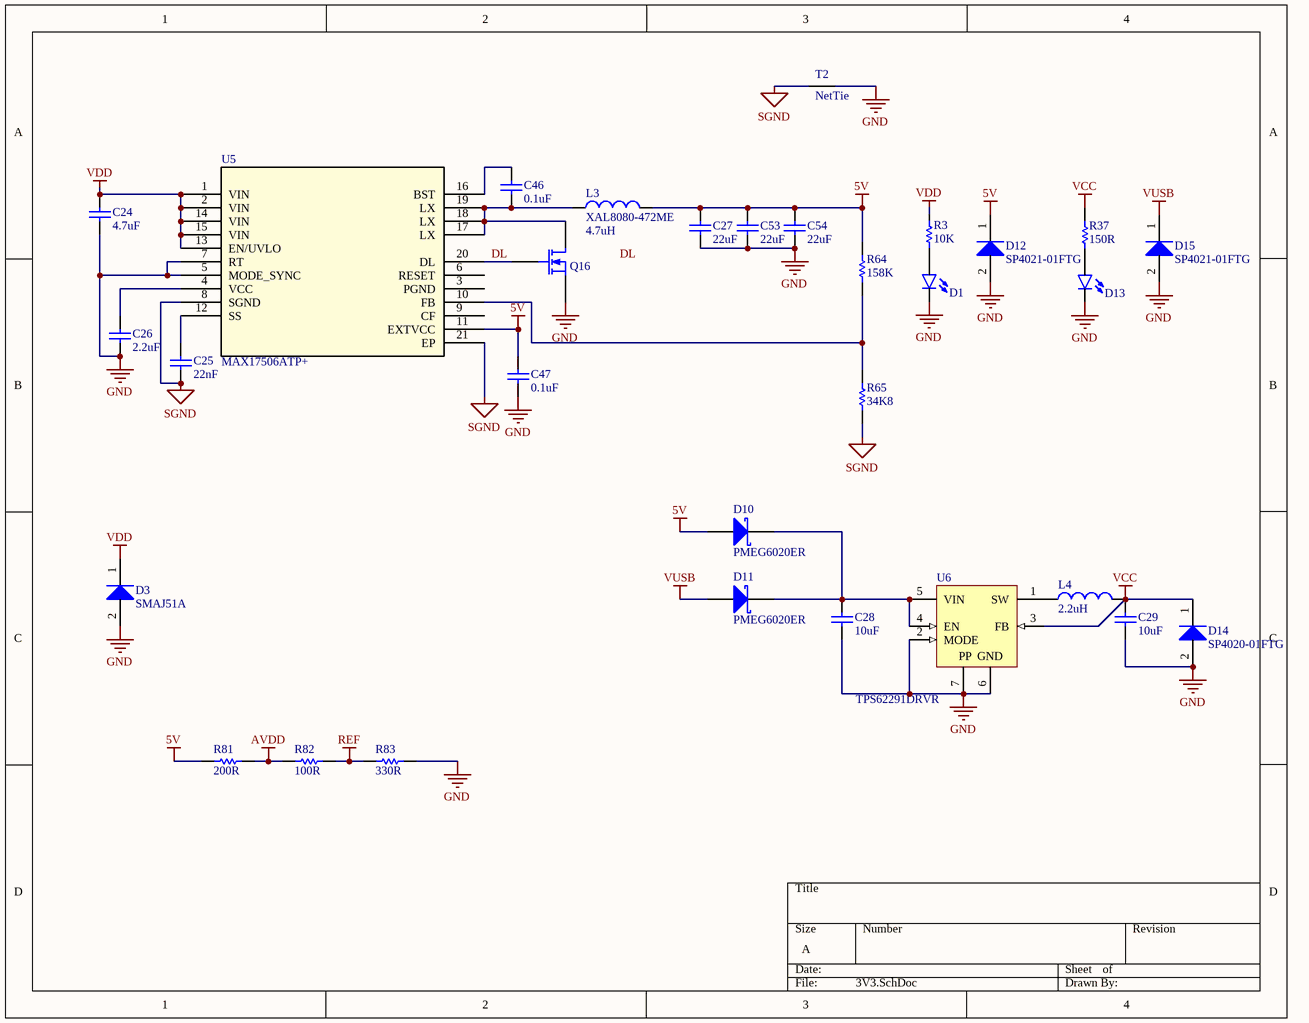
[diagram p6: 3V3.SchDoc]

### Parts
C24  value 4.7uF  [C1210[3225X200]]  (hidden comment: 4.7uF 100V 1210)
C25  value 22nF  [C0603[1608X92]]  (hidden comment: 22nF 50V 0603)
C26  value 2.2uF  [C0603[1608X92]]  (hidden comment: 2.2uF 10V 0603)
C27  value 22uF  [C1210[3225X250]]  (hidden comment: 22uF 16V 1210)
C28  value 10uF  [C0603[1608X92]]  (hidden comment: 10uF 16V 0603)
C29  value 10uF  [C0603[1608X92]]  (hidden comment: 10uF 6.3V 0603)
C46  value 0.1uF  [C0603[1608X92]]  (hidden comment: 0.1uF 16V 0603)
C47  value 0.1uF  [C0603[1608X92]]  (hidden comment: 0.1uF 6.3V 0603)
C53  value 22uF  [C1210[3225X250]]  (hidden comment: 22uF 16V 1210)
C54  value 22uF  [C1210[3225X250]]  (hidden comment: 22uF 16V 1210)
D1  LED_0603_GREEN_5mA  [LED0603]  (value not drawn)
D3  SMAJ51A  [DO-214AC]
D10  PMEG6020ER  [SOD-123]
D11  PMEG6020ER  [SOD-123]
D12  SP4021-01FTG  [SOD-323]
D13  LED_0603_GREEN_5mA  [LED0603]  (value not drawn)
D14  SP4020-01FTG  [SOD-323]
D15  SP4021-01FTG  [SOD-323]
L3  XAL8080-472ME  value 4.7uH  [XAL8080]
L4  2.2uH  [IND0805]
Q16  SIS862DN-T1-GE3  [PowerPak-1212-8]  (value not drawn)
R3  value 10K  [R0603[1608]]  (hidden comment: 10K 1% 0603)
R37  value 150R  [R0603[1608]]  (hidden comment: 150R 1% 0603)
R64  value 158K  [R0603[1608]]  (hidden comment: 158K 1% 0603)
R65  value 34K8  [R0603[1608]]  (hidden comment: 34K8 1% 0603)
R81  value 200R  [R0603[1608]]  (hidden comment: 200R 1% 0603)
R82  value 100R  [R0603[1608]]  (hidden comment: 100R 1% 0603)
R83  value 330R  [R0603[1608]]  (hidden comment: 330R 1% 0603)
T2  NetTie  [NetTie]  (net tie, no BOM)
U5  MAX17506ATP+  [21-0140L_T2055-4]
U6  TPS62291DRVR  [WSON-6]

### Nets
5V: C27.2 C47.2 C53.2 C54.2 D10.2(A) D12.1(K) L3.2 R64.2 R81.1 U5.11(EXTVCC)
AVDD: R81.2 R82.1
GND: C24.1 C26.1 C27.1 C28.1 C29.1 C47.1 C53.1 C54.1 D1.C D3.2(A) D12.2(A) D13.C D14.2(A) D15.2(A) Q16.1(S) R83.2 T2.2 U5.5(MODE_SYNC) U5.7(RT) U6.2(MODE) U6.6(GND) U6.7(EP)
REF: R82.2 R83.1
SGND: C25.1 R65.1 T2.1 U5.8(SGND) U5.21(EP)
VCC: C29.2 D14.1(K) L4.2 R37.2 U6.3(FB)
VDD: C24.2 D3.1(K) R3.2 U5.1(VIN) U5.2(VIN) U5.13(EN/UVLO) U5.14(VIN) U5.15(VIN)
VUSB: D11.2(A) D15.1(K)
DL: Q16.2(G) U5.20(DL)
NetC25_2: C25.2 U5.12(SS)
NetC26_2: C26.2 U5.4(VCC)
NetC28_2: C28.2 D10.1(K) D11.1(K) U6.4(EN) U6.5(VIN)
NetC46_1: C46.1 L3.1 Q16.3(D) U5.17(LX) U5.18(LX) U5.19(LX)
NetC46_2: C46.2 U5.16(BST)
NetD1_A: D1.A R3.1
NetD13_A: D13.A R37.1
NetL4_1: L4.1 U6.1(SW)
NetR64_1: R64.1 R65.2 U5.10(FB)

Not connected (* = marked no-connect by the designer): U5 3(PGND) 6(RESET) 9(CF)

### Notes on the sheet
- Labels drawn without touching a wire or pin: DL
- (in symbol TPS62291DRVR) PP

### Library data of the parts
C24 = CAP_4.7uF_100V_1210_10%: 4.7uF 100V 10% 1210 (3225 Metric); PartNumber: GRJ32DC72A475KE11L; Manufacturer: Murata; Mounting Technology: Surface Mount; PackageReference: 1210; PackageDescription: 1210 (3225 Metric); Voltage: 100V; Tolerance: 10%
C25 = CAP_22nF_50V_0603_10%: 22nF 50V 10% 0603 (1608 Metric); PartNumber: GRM188R71H223KA01D; Manufacturer: Murata; TemperatureCoefficient: X7R; Mounting Technology: Surface Mount; PackageReference: 0603; PackageDescription: 0603 (1608 Metric); Voltage: 50V; Tolerance: 10%
C26 = CAP_2.2uF_10V_0603_10%: 2.2uF 10V 10% 0603 (1608 Metric); PartNumber: GRT188R61A225KE13D; Manufacturer: Murata; TemperatureCoefficient: X5R; Mounting Technology: Surface Mount; PackageReference: 0603; PackageDescription: 0603 (1608 Metric); Voltage: 10V; Tolerance: 10%
C27 C53 C54 = CAP_22uF_16V_1210_20%: 22uF 16V 20% 1210 (3225 Metric); PartNumber: GRM32ER61C476ME15L; Manufacturer: Murata; Mounting Technology: Surface Mount; PackageReference: 1210; PackageDescription: 1210 (3225 Metric); Voltage: 16V; Tolerance: 20%
C28 = CAP_10uF_16V_0603_10%: 10uF 16V 10% 0603 (1608 Metric); PartNumber: GRM188R61C106KAALD; Manufacturer: Murata; TemperatureCoefficient: X5R; Mounting Technology: Surface Mount; PackageReference: 0603; PackageDescription: 0603 (1608 Metric); Voltage: 16V; Tolerance: 10%
C29 = CAP_10uF_6.3V_0603_10%: 10uF 6.3V 10% 0603 (1608 Metric); PartNumber: GRM188R60J106KE47D; Manufacturer: Murata; TemperatureCoefficient: X5R; Mounting Technology: Surface Mount; PackageReference: 0603; PackageDescription: 0603 (1608 Metric); Voltage: 6.3V; Tolerance: 10%
C46 = CAP_0.1uF_16V_0603_10%: 0.1uF 16V 10% 0603 (1608 Metric); PartNumber: GCM188R71C104KA37D; Manufacturer: Murata; TemperatureCoefficient: X7R; Mounting Technology: Surface Mount; PackageReference: 0603; PackageDescription: 0603 (1608 Metric); Voltage: 16V; Tolerance: 10%
C47 = CAP_0.1uF_6.3V_0603_10%: as C6 on sheet MCU; Mounting Technology: Surface Mount; PackageReference: 0603; PackageDescription: 0603 (1608 Metric); Voltage: 6.3V; Tolerance: 10%
D1 D13 = LED_0603_GREEN_5mA: PartNumber: LTST-C193TGKT-5A; Manufacturer: Lite-On Inc.; PackageReference: 0603; PackageDescription: 0603 (1608 Metric); Mounting Technology: Surface Mount
D3 = SMAJ51A-E3/61: Manufacturer: Vishay; PartNumber: SMAJ51A-E3/61; PackageReference: DO-214AC; Mounting Technology: Surface Mount; PackageDescription: DO-214AC, 2 Leads
D10 D11 = PMEG6020ER: PartNumber: PMEG6020ER,115; Manufacturer: NXP Semiconductors; PackageReference: SOD-123W; PackageDescription: SOD, 2-Leads, Body 2.69x1.6mm; Mounting Technology: Surface Mount
D12 D15 = SP4021-01FTG: Manufacturer: Littelfuse; PartNumber: SP4021-01FTG; PackageReference: SOD-323-2; Mounting Technology: Surface Mount
D14 = SP4020-01FTG: Manufacturer: Littelfuse; PartNumber: SP4020-01FTG; PackageReference: SOD-323-2; Mounting Technology: Surface Mount
L3 = XAL8080-472ME: 4.7uH 38A 4.08mOhms; PartNumber: XAL8080-472MED; Manufacturer: Coilcraft; Published: 8-Jun-2000; PackageReference: 0402-A; Publisher: Altium Limited; PackageDescription: Chip Inductor
L4 = IND_2.2uH_1.7A_0805_20%: 2.2uH 20% 1.7A 0805; PartNumber: LQM21PN2R2MGHL; Manufacturer: Murata; PackageReference: 0805; PackageDescription: 0805 (2012 metric); Value: 2.2uH; Mounting Technology: Surface Mount; Current: 1.7A
Q16 = SIS862DN-T1-GE3: N-Channel MOSFET; Manufacturer: Vishay; PartNumber: SIS862DN-T1-GE3; Mounting Technology: Surface Mount; PackageReference: PowerPAK-1212-8
R3 = RES_10K_0603_1%: as R19 on sheet MCU; Tolerance: 1%; Power: 0.25W; Mounting Technology: Surface Mount; PackageReference: 0603; PackageDescription: 0603 (1608 Metric); ComponentLink1Description: Datasheet; ComponentLink1URL: http://www.vishay.com/docs/20065/rcse3.pdf
R37 = RES_150R_0603_1%: as R68 on sheet ADC; Tolerance: 1%; Power: 0.25W; Mounting Technology: Surface Mount; PackageReference: 0603; PackageDescription: 0603 (1608 Metric); ComponentLink1Description: Datasheet; ComponentLink1URL: http://www.vishay.com/docs/20043/crcwhpe3.pdf
R64 = RES_158K_0603_1%: 158K 0.25W 1% 0603 (1005 Metric); Manufacturer: Vishay / Dale; PartNumber: CRCW0603158KFKEAHP; Tolerance: 1%; Power: 0.25W; Mounting Technology: Surface Mount; PackageReference: 0603; PackageDescription: 0603 (1608 Metric); ComponentLink1Description: Datasheet; ComponentLink1URL: http://www.vishay.com/docs/20043/crcwhpe3.pdf
R65 = RES_34K8_0603_1%: 34K8 0.25W 1% 0603 (1005 Metric); Manufacturer: Vishay / Dale; PartNumber: CRCW060334K8FKEAHP; Tolerance: 1%; Power: 0.25W; Mounting Technology: Surface Mount; PackageReference: 0603; PackageDescription: 0603 (1608 Metric); ComponentLink1Description: Datasheet; ComponentLink1URL: http://www.vishay.com/docs/20043/crcwhpe3.pdf
R81 = RES_200R_0603_1%: as R66 on sheet ADC; Tolerance: 1%; Power: 0.25W; Mounting Technology: Surface Mount; PackageReference: 0603; PackageDescription: 0603 (1608 Metric); ComponentLink1Description: Datasheet; ComponentLink1URL: http://www.vishay.com/docs/20043/crcwhpe3.pdf
R82 = RES_100R_0603_1%: 100R 0.25W 1% 0603 (1005 Metric); Manufacturer: Vishay / Dale; PartNumber: CRCW0603100RFKEAHP; Tolerance: 1%; Power: 0.25W; Mounting Technology: Surface Mount; PackageReference: 0603; PackageDescription: 0603 (1608 Metric); ComponentLink1Description: Datasheet; ComponentLink1URL: http://www.vishay.com/docs/20043/crcwhpe3.pdf
R83 = RES_330R_0603_1%: 330R 0.25W 1% 0603 (1005 Metric); Manufacturer: Vishay / Dale; PartNumber: CRCW0603330RFKEAHP; Tolerance: 1%; Power: 0.25W; Mounting Technology: Surface Mount; PackageReference: 0603; PackageDescription: 0603 (1608 Metric); ComponentLink1Description: Datasheet; ComponentLink1URL: http://www.vishay.com/docs/20043/crcwhpe3.pdf
U5 = MAX17506ATP+: Manufacturer: Maxim; Value: Value; Type: Type; RefDes: RefDes; PartNumber: MAX17506ATP+
U6 = TPS62291DRVR: Voltage Regulators - Switching Regulators 2.25MHz 1A Step-Down Cnvrtr 3.3V Output; Manufacturer: Texas Instruments; PartNumber: TPS62291DRVR; PackageReference: WSON-6; PackageDescription: SON, 6-Leads, Body 2x2mm, Pitch 0.65mm, Thermal Pad 1.6x1mm, TI Recommended; Mounting Technology: Surface Mount

## Sheet Flash.SchDoc
size A; SheetNumber: 12
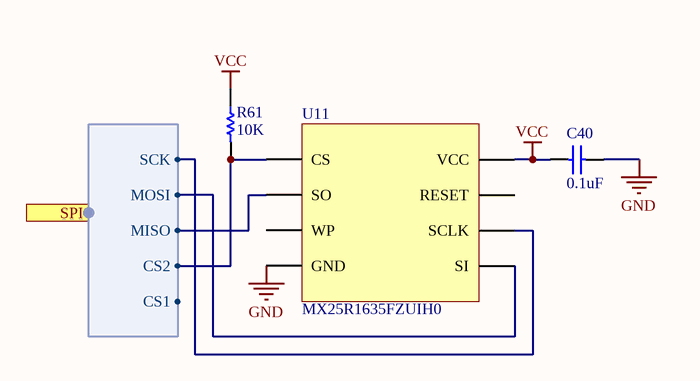
[diagram p7: Flash.SchDoc]

### Parts
C40  value 0.1uF  [C0603[1608X92]]  (hidden comment: 0.1uF 6.3V 0603)
R61  value 10K  [R0603[1608]]  (hidden comment: 10K 1% 0603)
U11  MX25R1635FZUIH0  [USON-8]

### Ports
SPI (harness SPI)

### Harnesses
SPI: SCK, MOSI, MISO, CS2, CS1

### Nets
GND: C40.2 U11.4(GND)
VCC: C40.1 R61.2 U11.8(VCC)
SPI2.CS2: R61.1 U11.1(CS) ; port SPI.CS2
SPI2.MISO: U11.2(SO) ; port SPI.MISO
SPI2.MOSI: U11.5(SI) ; port SPI.MOSI
SPI2.SCK: U11.6(SCLK) ; port SPI.SCK

Not connected (* = marked no-connect by the designer): U11 3(WP) 7(RESET)

### Library data of the parts
C40 = CAP_0.1uF_6.3V_0603_10%: as C6 on sheet MCU; Mounting Technology: Surface Mount; PackageReference: 0603; PackageDescription: 0603 (1608 Metric); Voltage: 6.3V; Tolerance: 10%
R61 = RES_10K_0603_1%: as R19 on sheet MCU; Tolerance: 1%; Power: 0.25W; Mounting Technology: Surface Mount; PackageReference: 0603; PackageDescription: 0603 (1608 Metric); ComponentLink1Description: Datasheet; ComponentLink1URL: http://www.vishay.com/docs/20065/rcse3.pdf
U11 = MX25R1635FZUIH0: pin to pad: 4>4+9; Manufacturer: Macronix; PartNumber: MX25R1635FZUIH0; Mounting Technology: Surface Mount; PackageReference: USON-8

## Nets that join several sheets
5V: A_L (R66_A_L.2 R67_A_L.2), A_R (R66_A_R.2 R67_A_R.2), Connectors (7 pins), 3V3 (10 pins)
AVDD: A_L (C68_A_L.2 U12_A_L.9), A_R (C68_A_R.2 U12_A_R.9), 3V3 (R81.2 R82.1)
GND: MCU (25 pins), A_L (12 pins), A_R (12 pins), Connectors (15 pins), CAN (C32.2 U8.2), Bluetooth (R84.2 U13.1), 3V3 (22 pins), Flash (C40.2 U11.4)
REF: A_L (C70_A_L.2 C71_A_L.2 U12_A_L.14), A_R (C70_A_R.2 C71_A_R.2 U12_A_R.14), 3V3 (R82.2 R83.1)
VCC: MCU (34 pins), A_L (C48_A_L.2 C49_A_L.2 U12_A_L.22), A_R (C48_A_R.2 C49_A_R.2 U12_A_R.22), Connectors (5 pins), CAN (C32.1 U8.3), Bluetooth (U13.15 U13.24), 3V3 (5 pins), Flash (C40.1 R61.2 U11.8)
VUSB: MCU (U2.69), Connectors (JP6.1), 3V3 (D11.2 D15.1)
AINP: A_L (C55_A_L.2 R69_A_L.1 U12_A_L.12), Connectors (JP7.4)
AINP: A_R (C55_A_R.2 R69_A_R.1 U12_A_R.12), Connectors (JP7.1)
NetJP1_3: MCU (U2.43), Connectors (JP1.3)
NetJP4_3: MCU (U2.68), Connectors (JP4.3)
NetJP8_2: MCU (U2.34), Connectors (JP8.2)
NetJP9_2: MCU (U2.91), Connectors (JP9.2)
NetJP10_1: MCU (U2.61), Connectors (JP10.1)
NetJP11_1: MCU (U2.62), Connectors (JP11.1)
NetJP16_2: MCU (U2.35), Connectors (JP16.2)
NetJP17_2: MCU (U2.90), Connectors (JP17.2)
NetJP19_1: Connectors (JP19.1), CAN (R58.2 U8.7)
NetJP19_2: Connectors (JP19.2), CAN (R58.1 U8.6)
SPI1.MISO: A_L (U12_A_L.2), A_R (U12_A_R.2)
SPI1.MOSI: A_L (U12_A_L.1), A_R (U12_A_R.1)
SPI1.RSTB: A_L (U12_A_L.5), A_R (U12_A_R.5)
SPI1.SCK: A_L (U12_A_L.24), A_R (U12_A_R.24)
SPI1.SYNC: A_L (U12_A_L.4), A_R (U12_A_R.4)